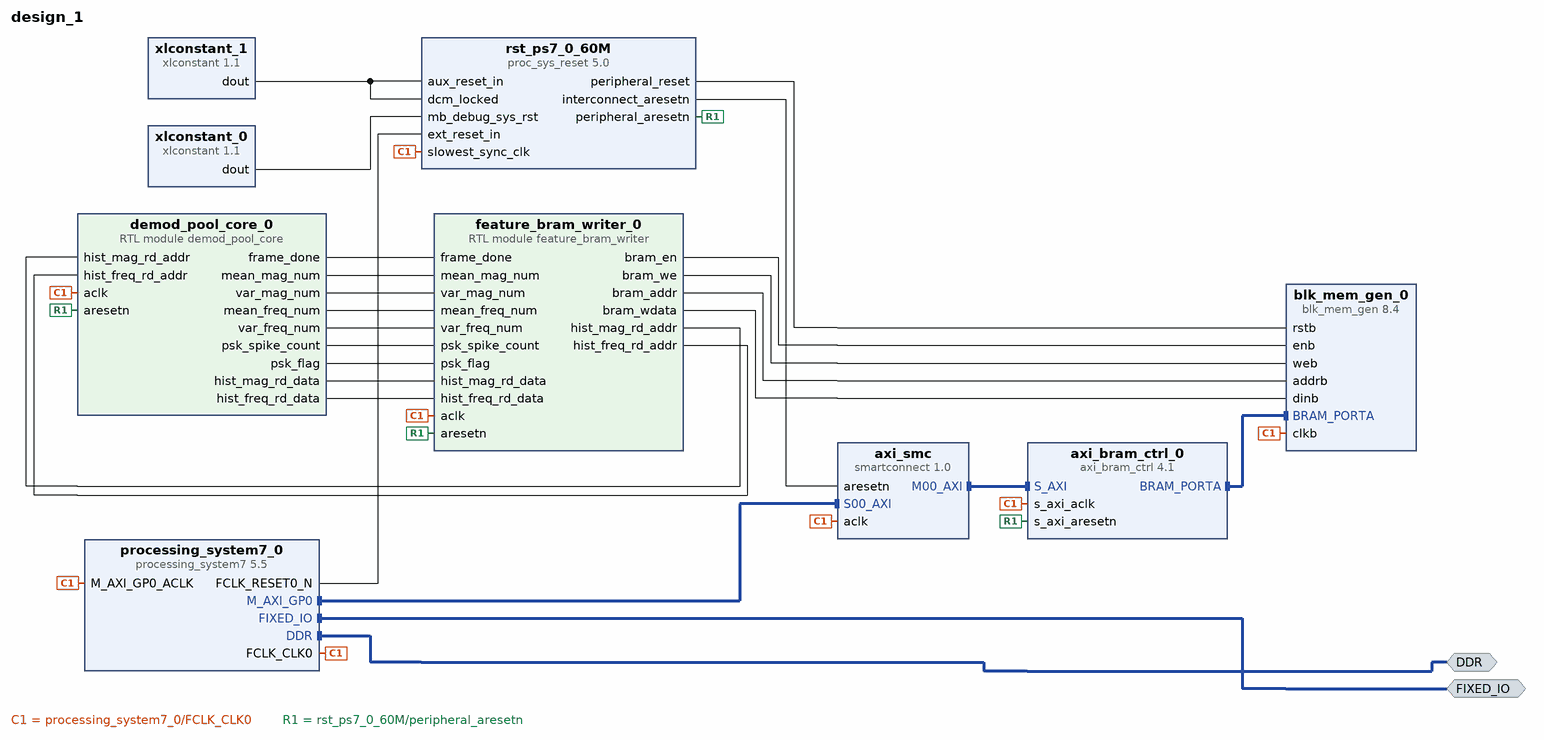
[diagram p0: block diagram of the top level]
# Vivado block design design_1, xc7z020clg400-2, Vivado 2018.3
create_bd_design design_1

create_bd_intf_port -mode Master -vlnv xilinx.com:interface:ddrx_rtl:1.0 DDR
create_bd_intf_port -mode Master -vlnv xilinx.com:display_processing_system7:fixedio_rtl:1.0 FIXED_IO

create_bd_cell -type ip -vlnv xilinx.com:ip:processing_system7:5.5 processing_system7_0
set_property -dict [list \
  CONFIG.PCW_FPGA0_PERIPHERAL_FREQMHZ 60 \
  CONFIG.PCW_PRESET_BANK1_VOLTAGE {LVCMOS 1.8V} \
  CONFIG.PCW_UART0_PERIPHERAL_ENABLE 1 \
  CONFIG.PCW_UART0_UART0_IO {MIO 14 .. 15} \
  CONFIG.PCW_UART_PERIPHERAL_FREQMHZ 100 \
  CONFIG.PCW_UIPARAM_DDR_PARTNO {MT41J256M16 RE-125} \
] [get_bd_cells processing_system7_0]
# 42 more settings of processing_system7_0 are not shown: defaults, MIO pin electricals, DDR timing, and values the tool derives
create_bd_cell -type ip -vlnv xilinx.com:ip:axi_bram_ctrl:4.1 axi_bram_ctrl_0
set_property -dict {CONFIG.SINGLE_PORT_BRAM 1} [get_bd_cells axi_bram_ctrl_0]
create_bd_cell -type ip -vlnv xilinx.com:ip:blk_mem_gen:8.4 blk_mem_gen_0
set_property -dict [list \
  CONFIG.Assume_Synchronous_Clk true \
  CONFIG.Enable_B Use_ENB_Pin \
  CONFIG.Memory_Type True_Dual_Port_RAM \
  CONFIG.Port_A_Write_Rate 50 \
  CONFIG.Port_B_Clock 100 \
  CONFIG.Port_B_Enable_Rate 100 \
  CONFIG.Port_B_Write_Rate 50 \
  CONFIG.Use_RSTB_Pin true \
] [get_bd_cells blk_mem_gen_0]
create_bd_cell -type module -reference feature_bram_writer feature_bram_writer_0
create_bd_cell -type ip -vlnv xilinx.com:ip:proc_sys_reset:5.0 rst_ps7_0_60M
create_bd_cell -type ip -vlnv xilinx.com:ip:smartconnect:1.0 axi_smc
set_property -dict {CONFIG.NUM_SI 1} [get_bd_cells axi_smc]
create_bd_cell -type ip -vlnv xilinx.com:ip:xlconstant:1.1 xlconstant_0
set_property -dict {CONFIG.CONST_VAL 0} [get_bd_cells xlconstant_0]
create_bd_cell -type ip -vlnv xilinx.com:ip:xlconstant:1.1 xlconstant_1
create_bd_cell -type module -reference demod_pool_core demod_pool_core_0

# ---- connections ----

connect_bd_intf_net [get_bd_intf_ports FIXED_IO] [get_bd_intf_pins processing_system7_0/FIXED_IO]
connect_bd_intf_net [get_bd_intf_ports DDR] [get_bd_intf_pins processing_system7_0/DDR]
connect_bd_intf_net [get_bd_intf_pins axi_smc/M00_AXI] [get_bd_intf_pins axi_bram_ctrl_0/S_AXI]
connect_bd_intf_net [get_bd_intf_pins processing_system7_0/M_AXI_GP0] [get_bd_intf_pins axi_smc/S00_AXI]
connect_bd_intf_net [get_bd_intf_pins blk_mem_gen_0/BRAM_PORTA] [get_bd_intf_pins axi_bram_ctrl_0/BRAM_PORTA]
connect_bd_net [get_bd_pins processing_system7_0/FCLK_CLK0] \
  [get_bd_pins rst_ps7_0_60M/slowest_sync_clk] [get_bd_pins processing_system7_0/M_AXI_GP0_ACLK] [get_bd_pins axi_smc/aclk] \
  [get_bd_pins axi_bram_ctrl_0/s_axi_aclk] [get_bd_pins feature_bram_writer_0/aclk] [get_bd_pins blk_mem_gen_0/clkb] \
  [get_bd_pins demod_pool_core_0/aclk]
connect_bd_net [get_bd_pins processing_system7_0/FCLK_RESET0_N] [get_bd_pins rst_ps7_0_60M/ext_reset_in]
connect_bd_net -net rst_ps7_0_100M_peripheral_aresetn [get_bd_pins rst_ps7_0_60M/peripheral_aresetn] \
  [get_bd_pins axi_bram_ctrl_0/s_axi_aresetn] [get_bd_pins feature_bram_writer_0/aresetn] \
  [get_bd_pins demod_pool_core_0/aresetn]
connect_bd_net [get_bd_pins feature_bram_writer_0/bram_en] [get_bd_pins blk_mem_gen_0/enb]
connect_bd_net [get_bd_pins feature_bram_writer_0/bram_we] [get_bd_pins blk_mem_gen_0/web]
connect_bd_net [get_bd_pins feature_bram_writer_0/bram_addr] [get_bd_pins blk_mem_gen_0/addrb]
connect_bd_net [get_bd_pins feature_bram_writer_0/bram_wdata] [get_bd_pins blk_mem_gen_0/dinb]
connect_bd_net [get_bd_pins demod_pool_core_0/frame_done] [get_bd_pins feature_bram_writer_0/frame_done]
connect_bd_net [get_bd_pins demod_pool_core_0/mean_mag_num] [get_bd_pins feature_bram_writer_0/mean_mag_num]
connect_bd_net [get_bd_pins demod_pool_core_0/var_mag_num] [get_bd_pins feature_bram_writer_0/var_mag_num]
connect_bd_net [get_bd_pins demod_pool_core_0/mean_freq_num] [get_bd_pins feature_bram_writer_0/mean_freq_num]
connect_bd_net [get_bd_pins demod_pool_core_0/var_freq_num] [get_bd_pins feature_bram_writer_0/var_freq_num]
connect_bd_net [get_bd_pins demod_pool_core_0/psk_spike_count] [get_bd_pins feature_bram_writer_0/psk_spike_count]
connect_bd_net [get_bd_pins demod_pool_core_0/psk_flag] [get_bd_pins feature_bram_writer_0/psk_flag]
connect_bd_net [get_bd_pins feature_bram_writer_0/hist_mag_rd_addr] [get_bd_pins demod_pool_core_0/hist_mag_rd_addr]
connect_bd_net [get_bd_pins feature_bram_writer_0/hist_freq_rd_addr] [get_bd_pins demod_pool_core_0/hist_freq_rd_addr]
connect_bd_net [get_bd_pins demod_pool_core_0/hist_mag_rd_data] [get_bd_pins feature_bram_writer_0/hist_mag_rd_data]
connect_bd_net [get_bd_pins demod_pool_core_0/hist_freq_rd_data] [get_bd_pins feature_bram_writer_0/hist_freq_rd_data]
connect_bd_net -net rst_ps7_0_100M_peripheral_reset [get_bd_pins rst_ps7_0_60M/peripheral_reset] [get_bd_pins blk_mem_gen_0/rstb]
connect_bd_net [get_bd_pins xlconstant_1/dout] [get_bd_pins rst_ps7_0_60M/dcm_locked] [get_bd_pins rst_ps7_0_60M/aux_reset_in]
connect_bd_net [get_bd_pins xlconstant_0/dout] [get_bd_pins rst_ps7_0_60M/mb_debug_sys_rst]
connect_bd_net -net rst_ps7_0_100M_interconnect_aresetn [get_bd_pins rst_ps7_0_60M/interconnect_aresetn] [get_bd_pins axi_smc/aresetn]
set_property HDL_ATTRIBUTE.BMM_INFO_PROCESSOR {arm > design_1 axi_bram_ctrl_0} [get_bd_cells processing_system7_0]
set_property HDL_ATTRIBUTE.KEEP_HIERARCHY yes [get_bd_cells processing_system7_0]
set_property HDL_ATTRIBUTE.BMM_INFO_ADDRESS_SPACE {byte  0x40000000 32 > design_1 blk_mem_gen_0} [get_bd_cells axi_bram_ctrl_0]
set_property HDL_ATTRIBUTE.KEEP_HIERARCHY yes [get_bd_cells axi_bram_ctrl_0]

# ---- address map ----
assign_bd_address -offset 0x40000000 -range 8K -target_address_space [get_bd_addr_spaces processing_system7_0/Data] [get_bd_addr_segs axi_bram_ctrl_0/S_AXI/Mem0]

validate_bd_design
save_bd_design
